# Altium schematic sheet ESC_SCh.SchDoc
size A3; Organization: Altium Limited; Address1: L3, 12a Rodborough Rd; Address2: Frenchs Forest; Address3: NSW; Address4: Australia 2086
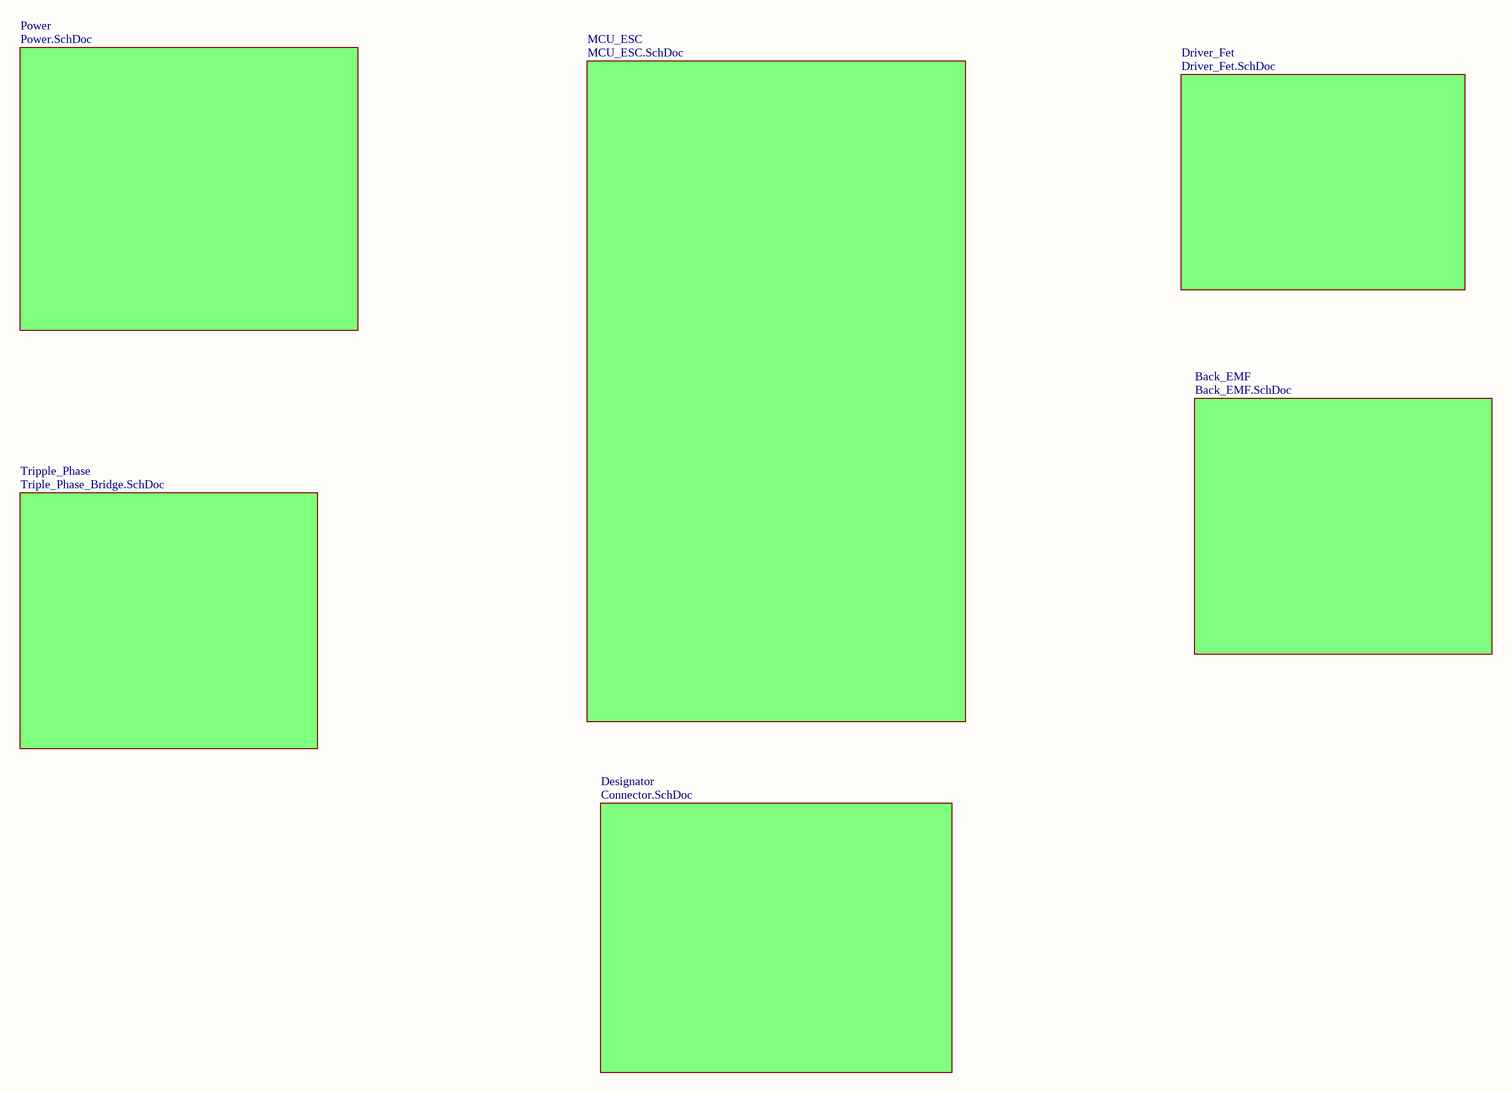
[diagram p0: ESC_SCh.SchDoc]

## Sub-sheets
Back_EMF = Back_EMF.SchDoc: no entries
Designator = Connector.SchDoc: no entries
Driver_Fet = Driver_Fet.SchDoc: no entries
MCU_ESC = MCU_ESC.SchDoc: no entries
Power = Power.SchDoc: no entries
Tripple_Phase = Triple_Phase_Bridge.SchDoc: no entries

## Notes on the sheet
- Title
- Size:
- Date:
- A3
- Number:
- Time:
- Revision:
- Sheet
- of
- File: